# Altium schematic sheet LED_String_NF2L757GT-F1.SchDoc: STB Light Board - 3000K String
size A4; Author: flmoll; DrawnBy: flmoll; Organization: PBL; Revision: A; SheetNumber: 6; SheetTotal: 20
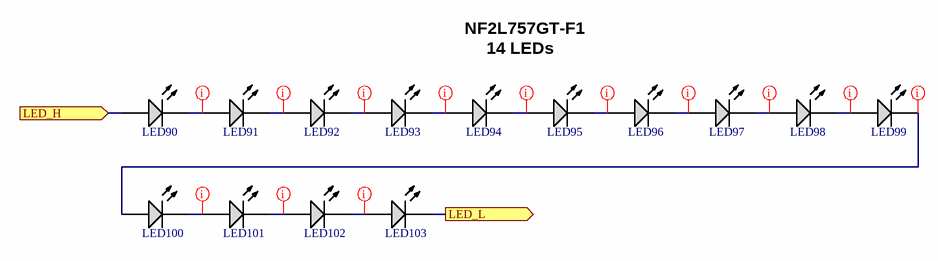
[diagram p0: LED_String_NF2L757GT-F1.SchDoc]

## Parts
LED90  NF2L757GT-F1  [NF2W757GT-F1]  (value not drawn)
LED91  NF2L757GT-F1  [NF2W757GT-F1]  (value not drawn)
LED92  NF2L757GT-F1  [NF2W757GT-F1]  (value not drawn)
LED93  NF2L757GT-F1  [NF2W757GT-F1]  (value not drawn)
LED94  NF2L757GT-F1  [NF2W757GT-F1]  (value not drawn)
LED95  NF2L757GT-F1  [NF2W757GT-F1]  (value not drawn)
LED96  NF2L757GT-F1  [NF2W757GT-F1]  (value not drawn)
LED97  NF2L757GT-F1  [NF2W757GT-F1]  (value not drawn)
LED98  NF2L757GT-F1  [NF2W757GT-F1]  (value not drawn)
LED99  NF2L757GT-F1  [NF2W757GT-F1]  (value not drawn)
LED100  NF2L757GT-F1  [NF2W757GT-F1]  (value not drawn)
LED101  NF2L757GT-F1  [NF2W757GT-F1]  (value not drawn)
LED102  NF2L757GT-F1  [NF2W757GT-F1]  (value not drawn)
LED103  NF2L757GT-F1  [NF2W757GT-F1]  (value not drawn)

## Ports
LED_H (in, see LED_Driver_NF2L757GT-F1[2A]), LED_L (out, see LED_Driver_NF2L757GT-F1[2A])

## Nets
LED_H: LED90.2(A) ; port LED_H
LED_L: LED103.1(K) ; port LED_L
NetLED90_1: LED90.1(K) LED91.2(A)
NetLED91_1: LED91.1(K) LED92.2(A)
NetLED92_1: LED92.1(K) LED93.2(A)
NetLED93_1: LED93.1(K) LED94.2(A)
NetLED94_1: LED94.1(K) LED95.2(A)
NetLED95_1: LED95.1(K) LED96.2(A)
NetLED96_1: LED96.1(K) LED97.2(A)
NetLED97_1: LED97.1(K) LED98.2(A)
NetLED98_1: LED98.1(K) LED99.2(A)
NetLED99_1: LED99.1(K) LED100.2(A)
NetLED100_1: LED100.1(K) LED101.2(A)
NetLED101_1: LED101.1(K) LED102.2(A)
NetLED102_1: LED102.1(K) LED103.2(A)

## Layout directives
net class LED: NetLED90_1, NetLED91_1, NetLED92_1, NetLED93_1, NetLED94_1, NetLED95_1, NetLED96_1, NetLED97_1, NetLED98_1, NetLED99_1, NetLED100_1, NetLED101_1, NetLED102_1

## Notes on the sheet
- NF2L757GT-F1
- 14 LEDs
- 1
- 2
- 3
- 4
- A
- B
- C
- Project:
- D
- Date:
- Drawing number:
- Rev:
- Format:
- A4 Q
- Drawn by:
- Laboratory:
- Page
- Sheet:
- of
- File:

## Library data of the parts
LED90-LED103 = CMP-02059-1: SMD LED White 2,76 V, 31,2 lm 3030 (1212); Manufacturer: Nichia; Manufacturer Part Number: NF2L757GT-F1 Optisolis; Optoelectronic Device Type: SINGLE COLOR LED; Vf: 2.76 V; Intensity: 31.2 lm; REACH SVHC: No SVHC; RoHS Compliant: Yes; Color: White